# Altium schematic sheet AdcPmodClock.SchDoc
size A4
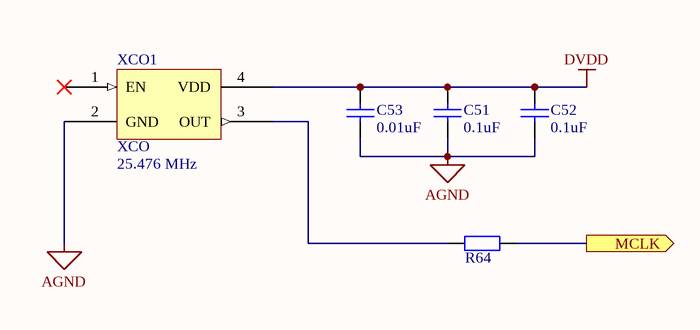
[diagram p0: AdcPmodClock.SchDoc]

## Parts
C51  0.1uF  [CAP0805]
C52  0.1uF  [CAP0805]
C53  0.01uF  [CAP0805]
R64  RES  [RES0805]  (value not drawn)
XCO1  XCO  Frequency: 25.476 MHz  [XCO 5x3.2mm (HS)]

## Ports
MCLK (out)

## Nets
AGND: C51.1 C52.1 C53.2 XCO1.2(GND)
DVDD: C51.2 C52.2 C53.1 XCO1.4(VDD)
MCLK: R64.2 ; port MCLK
NetR64_1: R64.1 XCO1.3(OUT)

Not connected (* = marked no-connect by the designer): XCO1 1(EN)*

## Library data of the parts
C51 C52 = CAP: Ceramic X7R; Manufacturer: AVX; Mfr. Part No.: 08055C104KAT2A; Suplier Part No.: 581-08055C104K; Value: 0.1uF; Supplier: Mouser
C53 = CAP: Ceramic X7R; Manufacturer: Murata Electronics; Mfr. Part No.: GRM216R71E103KA01D; Suplier Part No.: 81-GRM216R71E103KA01; Value: 0.01uF; Supplier: Mouser
R64 = RES: Resistor
XCO1 = XCO: Standard Clock Oscillator; Manufacturer: ABRACON; Mfr. Part No.: ASFL1-24.576MHZ-EC-T; Suplier Part No.: 815-ASFL1-24.5-EC-T; Supplier: Mouser